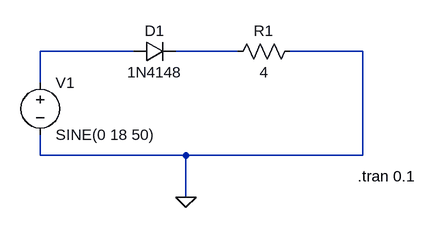
[diagram p0: schematic Draft4.asc]
Draft4.asc, the LTspice schematic file:
Version 4
SHEET 1 880 680
WIRE 192 80 48 80
WIRE 352 80 256 80
WIRE 544 80 432 80
WIRE 48 128 48 80
WIRE 48 240 48 208
WIRE 272 240 48 240
WIRE 544 240 544 80
WIRE 544 240 272 240
WIRE 272 304 272 240
FLAG 272 304 0
SYMBOL voltage 48 112 R0
WINDOW 123 0 0 Left 0
WINDOW 39 0 0 Left 0
SYMATTR InstName V1
SYMATTR Value SINE(0 18 50)
SYMBOL diode 192 96 R270
WINDOW 0 32 32 VTop 2
WINDOW 3 0 32 VBottom 2
SYMATTR InstName D1
SYMATTR Value 1N4148
SYMBOL res 448 64 R90
WINDOW 0 0 56 VBottom 2
WINDOW 3 32 56 VTop 2
SYMATTR InstName R1
SYMATTR Value 4
TEXT 536 272 Left 2 !.tran 0.1

The netlist it stands for:
* Draft4.asc
V1 N001 0 SINE(0 18 50)
D1 N001 N002 1N4148
R1 0 N002 4
.model D D
.lib standard.dio
.tran 0.1
.backanno
.end